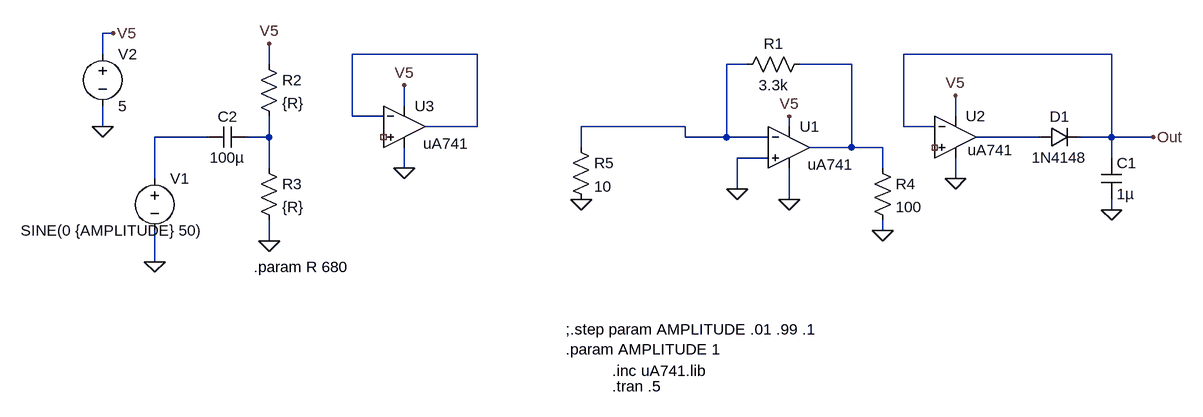
[diagram p0: schematic For-STC013-3.asc]
For-STC013-3.asc, the LTspice schematic file:
Version 4
SHEET 1 1644 680
WIRE -16 -32 -32 -32
WIRE -32 0 -32 -32
WIRE 544 0 352 0
WIRE 1520 0 1200 0
WIRE 224 16 224 -16
WIRE 960 16 928 16
WIRE 1120 16 1040 16
WIRE 432 80 432 48
WIRE 352 96 352 0
WIRE 400 96 352 96
WIRE 1280 96 1280 64
WIRE -32 112 -32 80
WIRE 544 112 544 0
WIRE 544 112 464 112
WIRE 864 112 704 112
WIRE 1024 112 1024 96
WIRE 1200 112 1200 0
WIRE 1248 112 1200 112
WIRE 128 128 48 128
WIRE 224 128 224 96
WIRE 224 128 192 128
WIRE 864 128 864 112
WIRE 928 128 928 16
WIRE 928 128 864 128
WIRE 992 128 928 128
WIRE 1408 128 1312 128
WIRE 1520 128 1520 0
WIRE 1520 128 1472 128
WIRE 1584 128 1520 128
WIRE 704 144 704 112
WIRE 1120 144 1120 16
WIRE 1120 144 1056 144
WIRE 1168 144 1120 144
WIRE 992 160 944 160
WIRE 1520 160 1520 128
WIRE 224 176 224 128
WIRE 432 176 432 144
WIRE 1168 176 1168 144
WIRE 48 192 48 128
WIRE 1280 192 1280 160
WIRE 944 208 944 160
WIRE 1024 224 1024 176
WIRE 1520 240 1520 224
WIRE 1168 272 1168 256
WIRE 224 288 224 256
WIRE 48 320 48 272
FLAG 48 320 0
FLAG -16 -32 V5
FLAG 1024 96 V5
FLAG 1584 128 Out
FLAG 1280 64 V5
FLAG 1520 240 0
FLAG -32 112 0
FLAG 944 208 0
FLAG 224 288 0
FLAG 224 -16 V5
FLAG 1024 224 0
FLAG 1280 192 0
FLAG 1168 272 0
FLAG 432 176 0
FLAG 432 48 V5
FLAG 704 224 0
SYMBOL voltage 48 176 R0
WINDOW 123 0 0 Left 0
WINDOW 39 0 0 Left 0
WINDOW 3 -206 96 Left 2
SYMATTR Value SINE(0 {AMPLITUDE} 50)
SYMATTR InstName V1
SYMBOL voltage -32 -16 R0
WINDOW 123 0 0 Left 0
WINDOW 39 0 0 Left 0
SYMATTR InstName V2
SYMATTR Value 5
SYMBOL OpAmps\\UniversalOpAmp 1024 144 R0
WINDOW 3 29 26 Left 2
SYMATTR Value uA741
SYMATTR InstName U1
SYMATTR SpiceModel ""
SYMATTR Value2 ""
SYMATTR SpiceLine ""
SYMBOL res 1056 0 R90
WINDOW 0 0 56 VBottom 2
WINDOW 3 32 56 VTop 2
SYMATTR InstName R1
SYMATTR Value 3.3k
SYMBOL OpAmps\\UniversalOpAmp 1280 128 R0
WINDOW 3 19 20 Left 2
SYMATTR Value uA741
SYMATTR InstName U2
SYMATTR SpiceModel ""
SYMBOL diode 1408 144 R270
WINDOW 0 32 32 VTop 2
WINDOW 3 0 32 VBottom 2
SYMATTR InstName D1
SYMATTR Value 1N4148
SYMBOL cap 1504 160 R0
SYMATTR InstName C1
SYMATTR Value 1µ
SYMBOL cap 192 112 R90
WINDOW 0 0 32 VBottom 2
WINDOW 3 32 32 VTop 2
SYMATTR InstName C2
SYMATTR Value 100µ
SYMBOL res 208 0 R0
SYMATTR InstName R2
SYMATTR Value {R}
SYMBOL res 208 160 R0
SYMATTR InstName R3
SYMATTR Value {R}
SYMBOL res 1152 160 R0
SYMATTR InstName R4
SYMATTR Value 100
SYMBOL OpAmps\\UniversalOpAmp 432 112 R0
WINDOW 3 29 26 Left 2
SYMATTR Value uA741
SYMATTR InstName U3
SYMATTR SpiceModel ""
SYMATTR Value2 ""
SYMATTR SpiceLine ""
SYMBOL res 688 128 R0
SYMATTR InstName R5
SYMATTR Value 10
TEXT 752 512 Left 2 !.tran .5
TEXT 752 488 Left 2 !.inc uA741.lib
TEXT 680 424 Left 2 !;.step param AMPLITUDE .01 .99 .1\n.param AMPLITUDE 1
TEXT 200 328 Left 2 !.param R 680

The netlist it stands for:
* For-STC013-3.asc
V1 N004 0 SINE(0 {AMPLITUDE} 50)
V2 V5 0 5
XU1 0 N002 V5 0 N003 uA741  ; pins In+ In- V+ V- OUT
R1 N003 N002 3.3k
XU2 NC_01 Out V5 0 N006 uA741 Avol=1Meg GBW=10Meg Vos=0 En=0 Enk=0 In=0 Ink=0 Rin=500Meg  ; pins In+ In- V+ V- OUT
D1 N006 Out 1N4148
C1 Out 0 1µ
C2 N005 N004 100µ
R2 V5 N005 {R}
R3 N005 0 {R}
R4 N003 0 100
XU3 NC_02 N001 V5 0 N001 uA741  ; pins In+ In- V+ V- OUT
R5 N002 0 10
.model D D
.lib standard.dio
.tran .5
.inc uA741.lib
;.step param AMPLITUDE .01 .99 .1
.param AMPLITUDE 1
.param R 680
.lib UniversalOpAmp1.lib
.backanno
.end